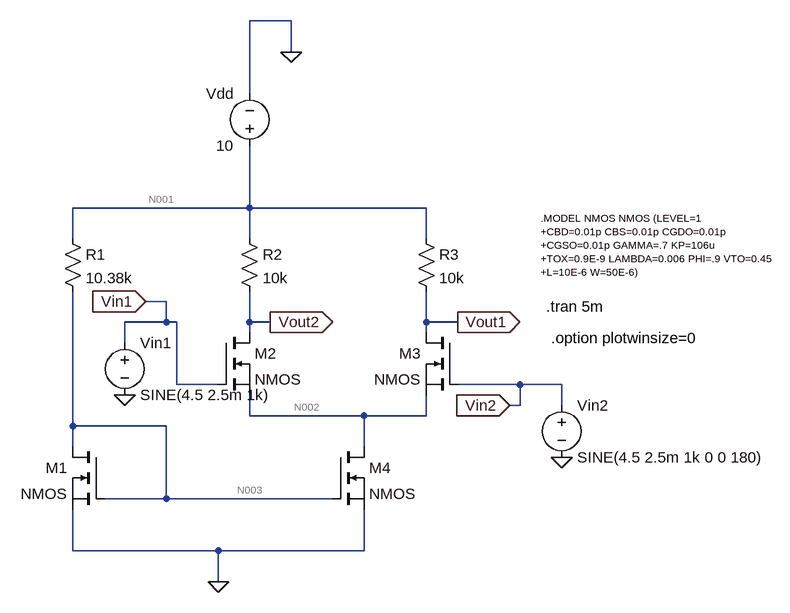
[diagram p0: schematic First.asc]
First.asc, the LTspice schematic file:
Version 4
SHEET 1 1316 680
WIRE 528 -240 464 -240
WIRE 528 -192 528 -240
WIRE 464 -128 464 -240
WIRE 464 48 464 -48
WIRE 464 48 192 48
WIRE 736 48 464 48
WIRE 192 96 192 48
WIRE 464 96 464 48
WIRE 736 96 736 48
WIRE 336 192 304 192
WIRE 336 224 336 192
WIRE 336 224 272 224
WIRE 352 224 336 224
WIRE 464 224 464 176
WIRE 496 224 464 224
WIRE 736 224 736 176
WIRE 784 224 736 224
WIRE 464 240 464 224
WIRE 736 240 736 224
WIRE 272 256 272 224
WIRE 352 320 352 224
WIRE 416 320 352 320
WIRE 880 320 784 320
WIRE 944 320 880 320
WIRE 880 352 880 320
WIRE 880 352 864 352
WIRE 944 352 944 320
WIRE 464 368 464 336
WIRE 640 368 464 368
WIRE 736 368 736 336
WIRE 736 368 640 368
WIRE 192 384 192 176
WIRE 336 384 192 384
WIRE 192 416 192 384
WIRE 640 416 640 368
WIRE 336 496 336 384
WIRE 336 496 240 496
WIRE 592 496 336 496
WIRE 192 576 192 512
WIRE 416 576 192 576
WIRE 640 576 640 512
WIRE 640 576 416 576
WIRE 416 624 416 576
FLAG 528 -192 0
FLAG 416 624 0
FLAG 944 432 0
FLAG 272 336 0
FLAG 784 224 Vout1
IOPIN 784 224 Out
FLAG 496 224 Vout2
IOPIN 496 224 Out
FLAG 864 352 Vin2
IOPIN 864 352 In
FLAG 304 192 Vin1
IOPIN 304 192 In
SYMBOL res 176 80 R0
SYMATTR InstName R1
SYMATTR Value 10.38k
SYMBOL res 448 80 R0
SYMATTR InstName R2
SYMATTR Value 10k
SYMBOL res 720 80 R0
SYMATTR InstName R3
SYMATTR Value 10k
SYMBOL nmos 240 416 M0
SYMATTR InstName M1
SYMBOL nmos 416 240 R0
SYMATTR InstName M2
SYMBOL nmos 784 240 M0
SYMATTR InstName M3
SYMBOL nmos 592 416 R0
SYMATTR InstName M4
SYMBOL voltage 464 -32 R180
WINDOW 0 24 96 Left 2
WINDOW 3 24 16 Left 2
WINDOW 123 0 0 Left 0
WINDOW 39 0 0 Left 0
SYMATTR InstName Vdd
SYMATTR Value 10
SYMBOL voltage 944 336 R0
WINDOW 123 0 0 Left 0
WINDOW 39 0 0 Left 0
SYMATTR InstName Vin2
SYMATTR Value SINE(4.5 2.5m 1k 0 0 180)
SYMBOL voltage 272 240 R0
WINDOW 123 0 0 Left 0
WINDOW 39 0 0 Left 0
SYMATTR InstName Vin1
SYMATTR Value SINE(4.5 2.5m 1k)
TEXT 912 64 Left 1 !.MODEL NMOS NMOS (LEVEL=1\n+CBD=0.01p CBS=0.01p CGDO=0.01p\n+CGSO=0.01p GAMMA=.7 KP=106u\n+TOX=0.9E-9 LAMBDA=0.006 PHI=.9 VTO=0.45\n+L=10E-6 W=50E-6)
TEXT 920 200 Left 2 !.tran 5m
TEXT 928 248 Left 2 !.option plotwinsize=0

The netlist it stands for:
* First.asc
R1 N001 N003 10.38k
R2 N001 Vout2 10k
R3 N001 Vout1 10k
M1 N003 N003 0 0 NMOS
M2 Vout2 Vin1 N002 N002 NMOS
M3 Vout1 Vin2 N002 N002 NMOS
M4 N002 N003 0 0 NMOS
Vdd N001 0 10
Vin2 Vin2 0 SINE(4.5 2.5m 1k 0 0 180)
Vin1 Vin1 0 SINE(4.5 2.5m 1k)
.model NMOS NMOS
.model PMOS PMOS
.lib standard.mos
.MODEL NMOS NMOS (LEVEL=1
+CBD=0.01p CBS=0.01p CGDO=0.01p
+CGSO=0.01p GAMMA=.7 KP=106u
+TOX=0.9E-9 LAMBDA=0.006 PHI=.9 VTO=0.45
+L=10E-6 W=50E-6)
.tran 5m
.option plotwinsize=0
.backanno
.end

* Results of the author's LTspice run, read from the files saved beside the schematic
* Operating Point, zero values left out:
*   V(n001) = 10 V
*   V(n003) = 2.131 V
*   V(vout2) = 6.193 V
*   V(vout1) = 6.193 V
*   V(vin1) = 4.5 V
*   V(n002) = 2.863 V
*   V(vin2) = 4.5 V
*   Id(M1) = 758.1 µA
*   Ib(M1) = -2.141 pA
*   Is(M1) = -758.1 µA
*   Id(M2) = 380.7 µA
*   Ib(M2) = -3.34 pA
*   Is(M2) = -380.7 µA
*   Id(M3) = 380.7 µA
*   Ib(M3) = -3.34 pA
*   Is(M3) = -380.7 µA
*   Id(M4) = 761.4 µA
*   Ib(M4) = -2.873 pA
*   Is(M4) = -761.4 µA
*   I(R1) = 758.1 µA
*   I(R2) = 380.7 µA
*   I(R3) = 380.7 µA
*   I(Vdd) = -1.52 mA
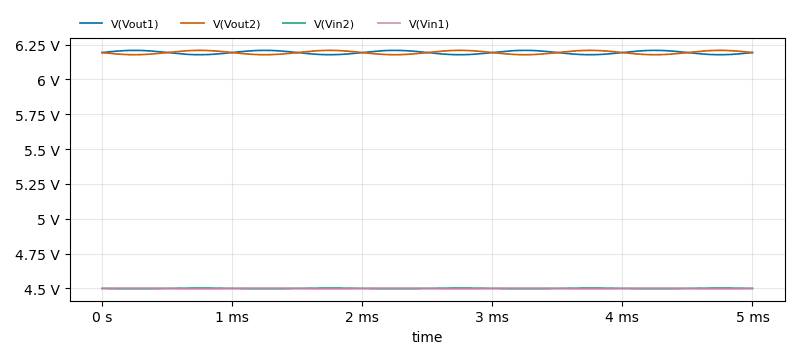
[diagram p1: Transient Analysis of First.asc, plotted from the saved traces]
* Transient Analysis, 1 run:
*   V(Vout1): min 6.177 V, max 6.209 V, average 6.193 V, rms 6.193 V, last 6.193 V
*   V(Vout2): min 6.177 V, max 6.209 V, average 6.193 V, rms 6.193 V, last 6.193 V
*   V(Vin2): min 4.497 V, max 4.503 V, average 4.5 V, rms 4.5 V, last 4.5 V
*   V(Vin1): min 4.497 V, max 4.503 V, average 4.5 V, rms 4.5 V, last 4.5 V